# EAGLE design Pit Crew (EAGLE 6.6.0)

## Sheet 1 of 2
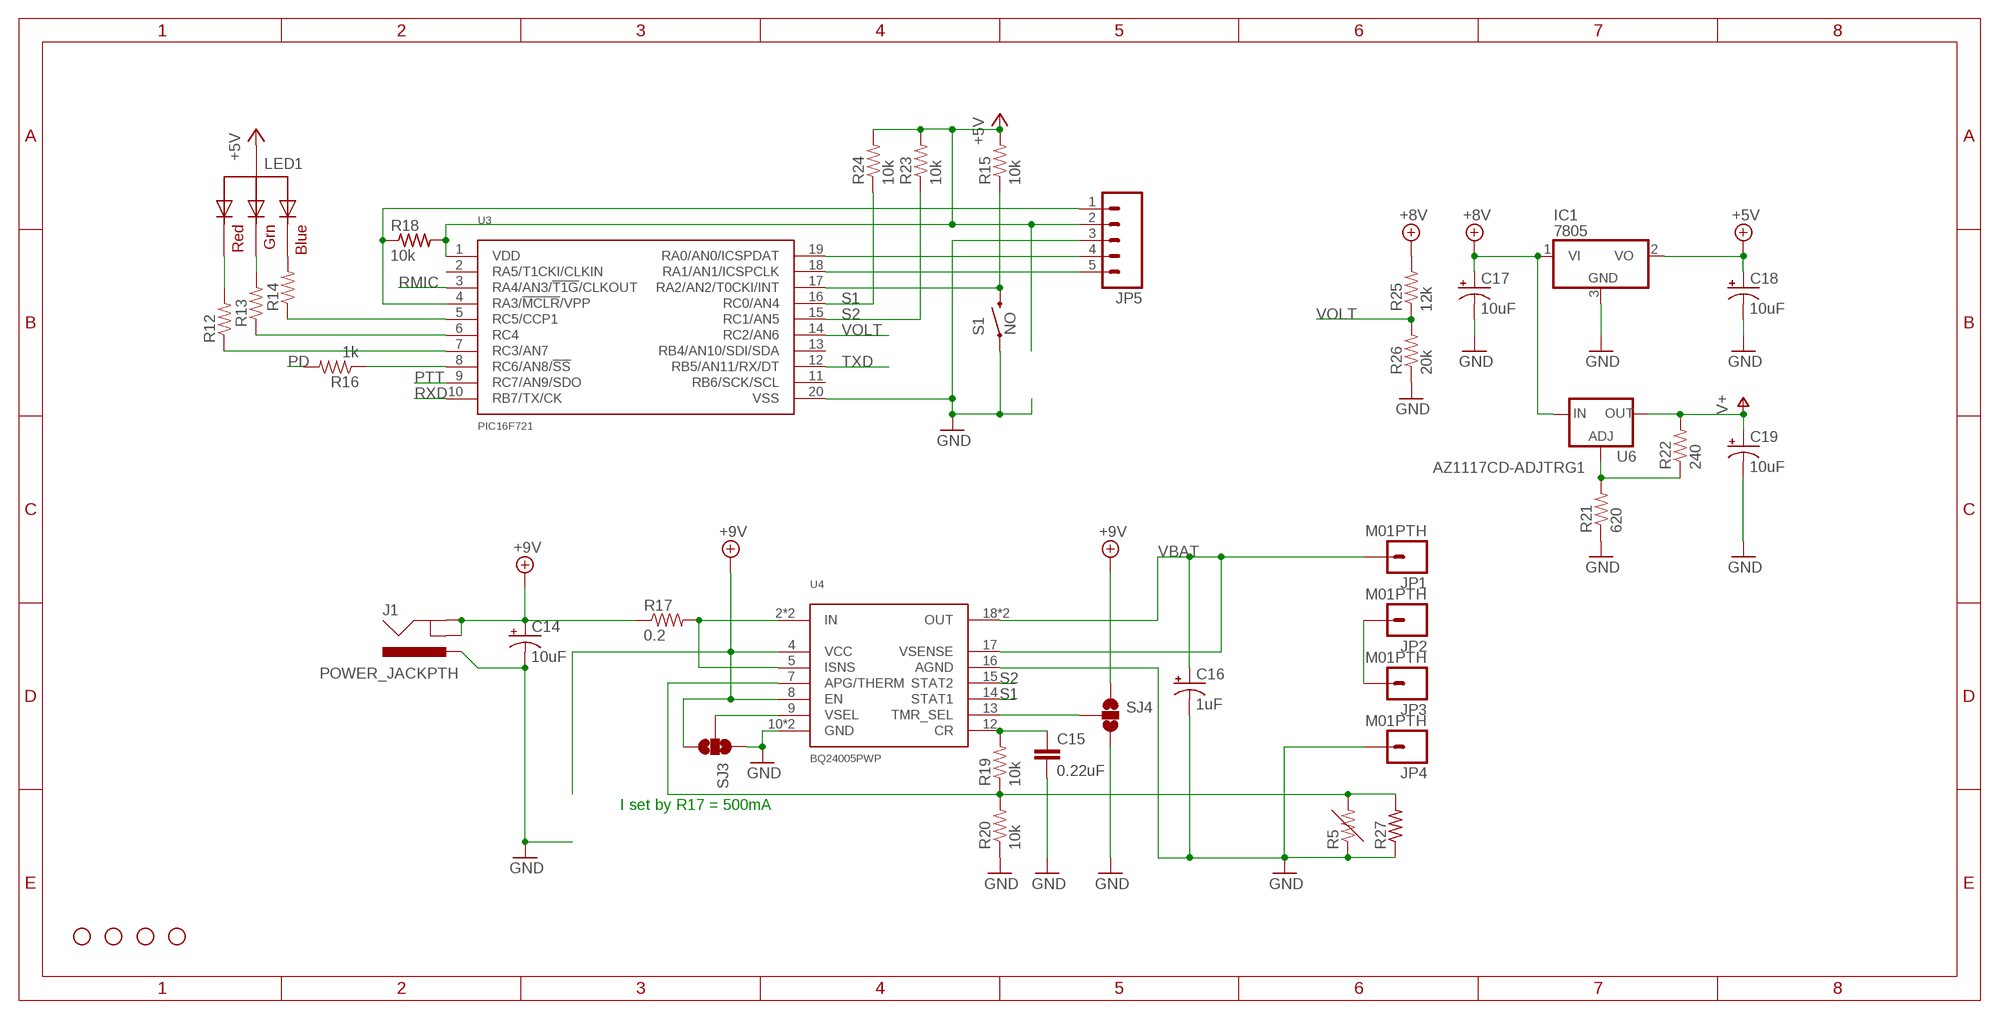
[diagram p0: schematic, sheet 1]

### Parts
C14  10uF  10UF-TANT  [EIA3216]
C15  0.22uF  CAP0805  [0805]
C16  1uF  10UF-TANT  [EIA3216]
C17  10uF  10UF-TANT  [EIA3216]
C18  10uF  10UF-TANT  [EIA3216]
C19  10uF  10UF-TANT  [EIA3216]
IC1  7805  7806DT  [TO252]
J1  POWER_JACKPTH  [POWER_JACK_PTH]
JP1  M01PTH  [1X01]
JP2  M01PTH  [1X01]
JP3  M01PTH  [1X01]
JP4  M01PTH  [1X01]
JP5  M05LOCK_LONGPADS  [1X05_LOCK_LONGPADS]
LED1  RGBLED_CA-5MM  [LED5MMRGB]
R5  RESISTOR0805-RES  [0805]
R12  RESISTOR0805-RES  [0805]
R13  RESISTOR0805-RES  [0805]
R14  RESISTOR0805-RES  [0805]
R15  10k  RESISTOR0805-RES  [0805]
R16  1k  RESISTOR0805-RES  [0805]
R17  0.2  RESISTOR2512  [R2512]
R18  10k  R-US_R0805  [R0805]
R19  10k  RESISTOR0805-RES  [0805]
R20  10k  RESISTOR0805-RES  [0805]
R21  620  RESISTOR0805-RES  [0805]
R22  240  RESISTOR0805-RES  [0805]
R23  10k  RESISTOR0805-RES  [0805]
R24  10k  RESISTOR0805-RES  [0805]
R25  12k  RESISTOR0805-RES  [0805]
R26  20k  RESISTOR0805-RES  [0805]
R27  R-US_0207/7  [0207/7]
S1  NO  SWITCH-MOMENTARY-2SIDE_EZ  [TACTILE-PTH-SIDEEZ]
SJ3  SOLDERJUMPER_2WAYS  [SJ_3]
SJ4  SOLDERJUMPER_2WAYS  [SJ_3]
STANDOFF1  STAND-OFF  [STAND-OFF]
STANDOFF2  STAND-OFF  [STAND-OFF]
STANDOFF3  STAND-OFF  [STAND-OFF]
STANDOFF4  STAND-OFF  [STAND-OFF]
U3  PIC16F721  [SSOP-20]
U4  BQ24005PWP  [HTSSOP-20]
U6  AZ1117CD-ADJTRG1  V_REG_317DPACK  [V-REG_DPACK]

### Nets
+5V: C18.A(+) IC1.2(VO) JP5.2 LED1.2(VCC) R15.2 R18.2 R23.2 R24.2 U3.1(VDD) ; also sheet 2
+8V: C17.A(+) IC1.1(VI) R25.2 U6.3(IN) ; also sheet 2
+9V: C14.A(+) J1.GND J1.GNDBREAK R17.1 SJ3.3 SJ4.1 U4.4(VCC) U4.8(EN)
GND: C14.C(-) C15.2 C16.C(-) C17.C(-) C18.C(-) C19.C(-) IC1.3(GND) J1.PWR JP4.1 JP5.3 R5.1 R20.1 R21.1 R26.1 R27.1 S1.1 SJ3.1 SJ4.3 U3.20(VSS) U4.10(GND) U4.16(AGND) U4.EP(GND) ; also sheet 2
N$11: LED1.1(RED) R12.2
N$13: LED1.4(BLUE) R14.2
N$19: LED1.3(GREEN) R13.2
N$20: JP2.1 JP3.1
N$21: R14.1 U3.5(RC5/CCP1)
N$22: R13.1 U3.6(RC4)
N$23: R12.1 U3.7(RC3/AN7)
N$24: R15.1 S1.2 U3.17(RA2/AN2/T0CKI/INT)
N$25: R16.1 U3.8(RC6/AN8/!SS!)
N$27: JP5.1 R18.1 U3.4(RA3/!MCLR!/VPP)
N$28: JP5.4 U3.19(RA0/AN0/ICSPDAT)
N$29: JP5.5 U3.18(RA1/AN1/ICSPCLK)
N$31: R17.2 U4.2(IN) U4.3(IN) U4.5(ISNS)
N$32: R21.2 R22.1 U6.1(ADJ)
N$33: SJ3.2 U4.9(VSEL)
N$34: R5.2 R19.1 R20.2 R27.2 U4.7(APG/THERM)
N$35: C15.1 R19.2 U4.12(CR)
N$36: SJ4.2 U4.13(TMR_SEL)
PD: R16.2 ; also sheet 2
PTT: U3.9(RC7/AN9/SDO) ; also sheet 2
RMIC: U3.3(RA4/AN3/!T1G!/CLKOUT) ; also sheet 2
RXD: U3.10(RB7/TX/CK) ; also sheet 2
S1: R24.1 U3.16(RC0/AN4) U4.14(STAT1)
S2: R23.1 U3.15(RC1/AN5) U4.15(STAT2)
TXD: U3.12(RB5/AN11/RX/DT) ; also sheet 2
V+: C19.A(+) R22.2 U6.4(OUT) ; also sheet 2
VBAT: C16.A(+) JP1.1 U4.17(VSENSE) U4.18(OUT) U4.19(OUT) ; also sheet 2
VOLT: R25.1 R26.2 U3.14(RC2/AN6)
Unconnected: U3.2(RA5/T1CKI/CLKIN) U3.11(RB6/SCK/SCL) U3.13(RB4/AN10/SDI/SDA)

### Notes on the sheet
- I set by R17 = 500mA

## Sheet 2 of 2
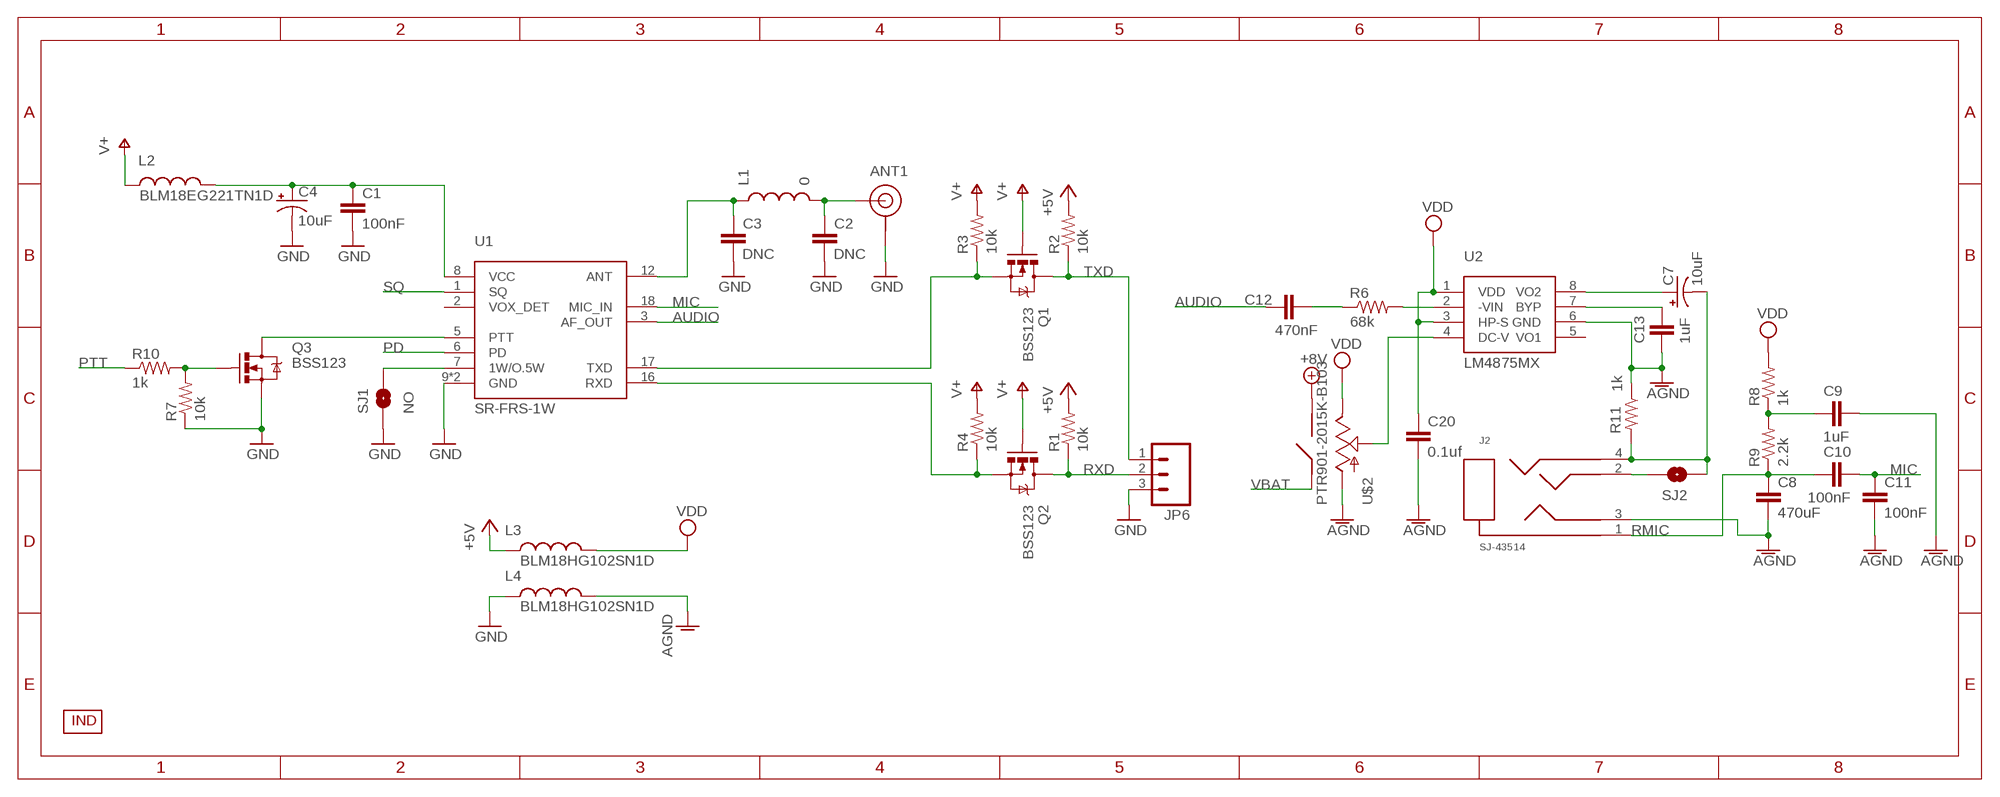
[diagram p1: schematic, sheet 2]

### Parts
ANT1  SMA  [CONSMA002]
C1  100nF  CAP0805  [0805]
C2  DNC  CAP0805  [0805]
C3  DNC  CAP0805  [0805]
C4  10uF  CAP_POL1206  [EIA3216]
C7  10uF  10UF-TANT  [EIA3216]
C8  470uF  CAP0805  [0805]
C9  1uF  CAP0805  [0805]
C10  100nF  CAP0805  [0805]
C11  100nF  CAP0805  [0805]
C12  470nF  CAP0805  [0805]
C13  1uF  CAP0805  [0805]
C20  0.1uf  CAP0805  [0805]
J2  SJ-43514  [SJ-43514]
JP6  M03LOCK  [1X03_LOCK]
L1  0  INDUCTOR1007  [1007]
L2  BLM18EG221TN1D  INDUCTOR0603  [0603]
L3  BLM18HG102SN1D  INDUCTOR0603  [0603]
L4  BLM18HG102SN1D  INDUCTOR0603  [0603]
Q1  BSS123  MOSFET-NCHANNELBSS123LT1G  [SOT23]
Q2  BSS123  MOSFET-NCHANNELBSS123LT1G  [SOT23]
Q3  BSS123  MOSFET-NCHANNELBSS123LT1G  [SOT23]
R1  10k  RESISTOR0805-RES  [0805]
R2  10k  RESISTOR0805-RES  [0805]
R3  10k  RESISTOR0805-RES  [0805]
R4  10k  RESISTOR0805-RES  [0805]
R6  68k  RESISTOR0805-RES  [0805]
R7  10k  RESISTOR0805-RES  [0805]
R8  1k  RESISTOR0805-RES  [0805]
R9  2.2k  RESISTOR0805-RES  [0805]
R10  1k  RESISTOR0805-RES  [0805]
R11  1k  RESISTOR0805-RES  [0805]
SJ1  NO  SOLDERJUMPERNO  [SJ_2S-NO]
SJ2  SOLDERJUMPERNO  [SJ_2S-NO]
U1  SR-FRS-1W  [SR-FRS-1W]
U2  LM4875MX  [SO-8]
U$2  PTR901-2015K-B103  [PTR901-2015K-B103]
U$3  INDPK1  [PICKIT-PIN-1]

### Nets
+5V: L3.1 R1.2 R2.2 ; also sheet 1
+8V: U$2.S1 ; also sheet 1
AGND: C8.2 C9.2 C11.2 C13.1 C20.2 J2.3 L4.2 R11.1 U2.6(GND) U$2.1(CCW)
AUDIO: C12.1 U1.3(AF_OUT)
GND: ANT1.1(GND) ANT1.2(GND) ANT1.3(GND) ANT1.4(GND) C1.2 C2.2 C3.2 C4.C(-) JP6.3 L4.1 Q3.2(S) R7.1 SJ1.1 U1.9(GND) U1.10(GND) ; also sheet 1
MIC: C10.2 C11.1 U1.18(MIC_IN)
N$1: C3.1 L1.1 U1.12(ANT)
N$2: ANT1.C(SIGNAL) C2.1 L1.2
N$3: C1.1 C4.A(+) L2.2 U1.8(VCC)
N$4: SJ1.2 U1.7(1W/O.5W)
N$6: J2.2 SJ2.1
N$7: U2.4(DC-V) U$2.2(W)
N$8: Q2.2(S) R4.1 U1.16(RXD)
N$9: Q1.2(S) R3.1 U1.17(TXD)
N$10: C13.2 U2.7(BYP)
N$12: C12.2 R6.1
N$14: R6.2 U2.2(-VIN)
N$15: C9.1 R8.1 R9.2
N$17: C7.A(+) U2.8(VO2)
N$18: Q3.1(G) R7.2 R10.2
N$26: C7.C(-) J2.4 R11.2 SJ2.2
PD: U1.6(PD) ; also sheet 1
PTT: R10.1 ; also sheet 1
PTT-1: Q3.3(D) U1.5(PTT)
RMIC: C8.1 C10.1 J2.1 R9.1 ; also sheet 1
RXD: JP6.2 Q2.3(D) R1.1 ; also sheet 1
SQ: U1.1(SQ)
TXD: JP6.1 Q1.3(D) R2.1 ; also sheet 1
V+: L2.1 Q1.1(G) Q2.1(G) R3.2 R4.2 ; also sheet 1
VBAT: U$2.S2 ; also sheet 1
VDD: C20.1 L3.2 R8.2 U2.1(VDD) U2.3(HP-S) U$2.3(CW)
Unconnected: U1.2(VOX_DET) U2.5(VO1)

## Library data of the parts
ANT1 = FSAE Eletric:SMA
C1-C3 C8-C13 C15 C20 = SparkFun-Passives:CAP: Capacitor Standard 0603 ceramic capacitor, and 0.1" leaded capacitor.
C4 = SparkFun-Passives:CAP_POL: Capacitor Polarized These are standard SMD and PTH capacitors. Normally 10uF, 47uF, and 100uF in electrolytic and tantalum varieties. Always verify the external diameter of the through hole cap, it varies with capacity, voltage, and manufacturer. The EIA devices should be standard.
C7 C14 C17-C19 = SparkFun-Capacitors:10UF-TANT: 10uF Tantalum SMT CAP-00811- 16V 10% (EIA-3216); PROD_ID: CAP-00811
C16 = SparkFun-Capacitors:10UF-TANT: 10uF Tantalum SMT CAP-00811- 16V 10% (EIA-3216); PROD_ID: CAP-00811; VALUE: 10uF
IC1 = adafruit:78*: Positive VOLTAGE REGULATOR Added bigger pads to the TO-92 package
J1 = SparkFun-Connectors:POWER_JACK: Power Jack This is the standard 5.5mm barrel jack for power. The PTH is the most common, proven, reliable, footprint. The Slot footprint only works if the mill layer is transmitted to the PCB fab house so be warned. Spark Fun Electronics SKU : PRT-00119 SMT: CONN-08106 Mating wall wart : TOL-00298 (and others)
J2 = FSAE Eletric:SJ-43514; PARTNO: SJ-43514
JP1-JP4 = SparkFun-Connectors:M01: Header 1 Standard 1-pin 0.1" header. Use with straight break away headers (SKU : PRT-00116), right angle break away headers (PRT-00553), swiss pins (PRT-00743), machine pins (PRT-00117), and female headers (PRT-00115).
JP5 = SparkFun-Connectors:M05: Header 5 Standard 5-pin 0.1" header. Use with straight break away headers (SKU : PRT-00116), right angle break away headers (PRT-00553), swiss pins (PRT-00743), machine pins (PRT-00117), and female headers (PRT-00115). Molex polarized connector foot print use with SKU : PRT-08230 with associated crimp pins and housings.
JP6 = SparkFun-Connectors:M03: Header 3 Standard 3-pin 0.1" header. Use with straight break away headers (SKU : PRT-00116), right angle break away headers (PRT-00553), swiss pins (PRT-00743), machine pins (PRT-00117), and female headers (PRT-00115). Molex polarized connector foot print use with SKU : PRT-08232 with associated crimp pins and housings.
L1-L4 = SparkFun-Passives:INDUCTOR: Inductors Basic Inductor/Choke - 0603 and 1206. Footprints are not proven and vary greatly between part numbers. SRN6045- 33uH, 20% 1.4A
LED1 = adafruit:RGBLED_CA: RGB LED, common-anode 5MM Staggered pins 5mm Piranha package http://www.ladyada.net/library/pcb/eaglelibrary.html
Q1-Q3 = SparkFun-DiscreteSemi:MOSFET-NCHANNEL: Common NMOSFET Parts MFG P/N Store ID Prod ID FDD8780 TRANS-09984 SI7820DN TRANS-11055 FDS6630A IC-08089 2N7002PW TRANS-11151 FQP30N06L COM-10213 TRANS-10060 BSS123LT1G TRANS-08345 BSS138 TRANS-00830 BS170 2N7000; PROD_ID: TRANS-08345
R1-R17 R19-R26 = SparkFun-Passives:RESISTOR: Resistor Basic schematic elements and footprints for 0603, 1206, and PTH resistors.
R18 R27 = adafruit:R-US_: RESISTOR, American symbol
S1 = SparkFun-Electromechanical:SWITCH-MOMENTARY-2: Various NO switches- pushbuttons, reed, etc
SJ1 SJ2 = SparkFun-Passives:SOLDERJUMPER: Solder Jumper Standard SMD solder jumper. Used to automate production. Two varients : Normally Open and Normally Closed are the same, but have different paste layers. NC will have a large amount of paste and should jumper during reflow.
SJ3 SJ4 = SparkFun-Passives:SOLDERJUMPER_2WAY: Solder Jumper 2 way solder jumper
STANDOFF1-STANDOFF4 = SparkFun-Electromechanical:STAND-OFF: #4 Stand Off This is the mechanical footprint for a #4 phillips button head screw. Use the keepout ring to avoid running the screw head into surrounding components. SKU : PRT-00447
U1 = FSAE Eletric:SR-FRS-1W
U2 = FSAE Eletric:LM4875MX
U3 = FSAE Eletric:PIC16F721
U4 = FSAE Eletric:BQ24005PWP
U6 = SparkFun-PowerIC:V_REG_317: Voltage Regulator Standard LM317 adjustable voltage regulator. AOI (Adjust Output Input). Google 'LM317 Calculator' for easy to use app to get the two resistor values needed. 240/720 for 5V output. 240/390 for 3.3V output. Spark Fun Electronics SKU : COM-00527
U$2 = FSAE Eletric:PTR901-2015K-B103
U$3 = FSAE Eletric:IND

## Board
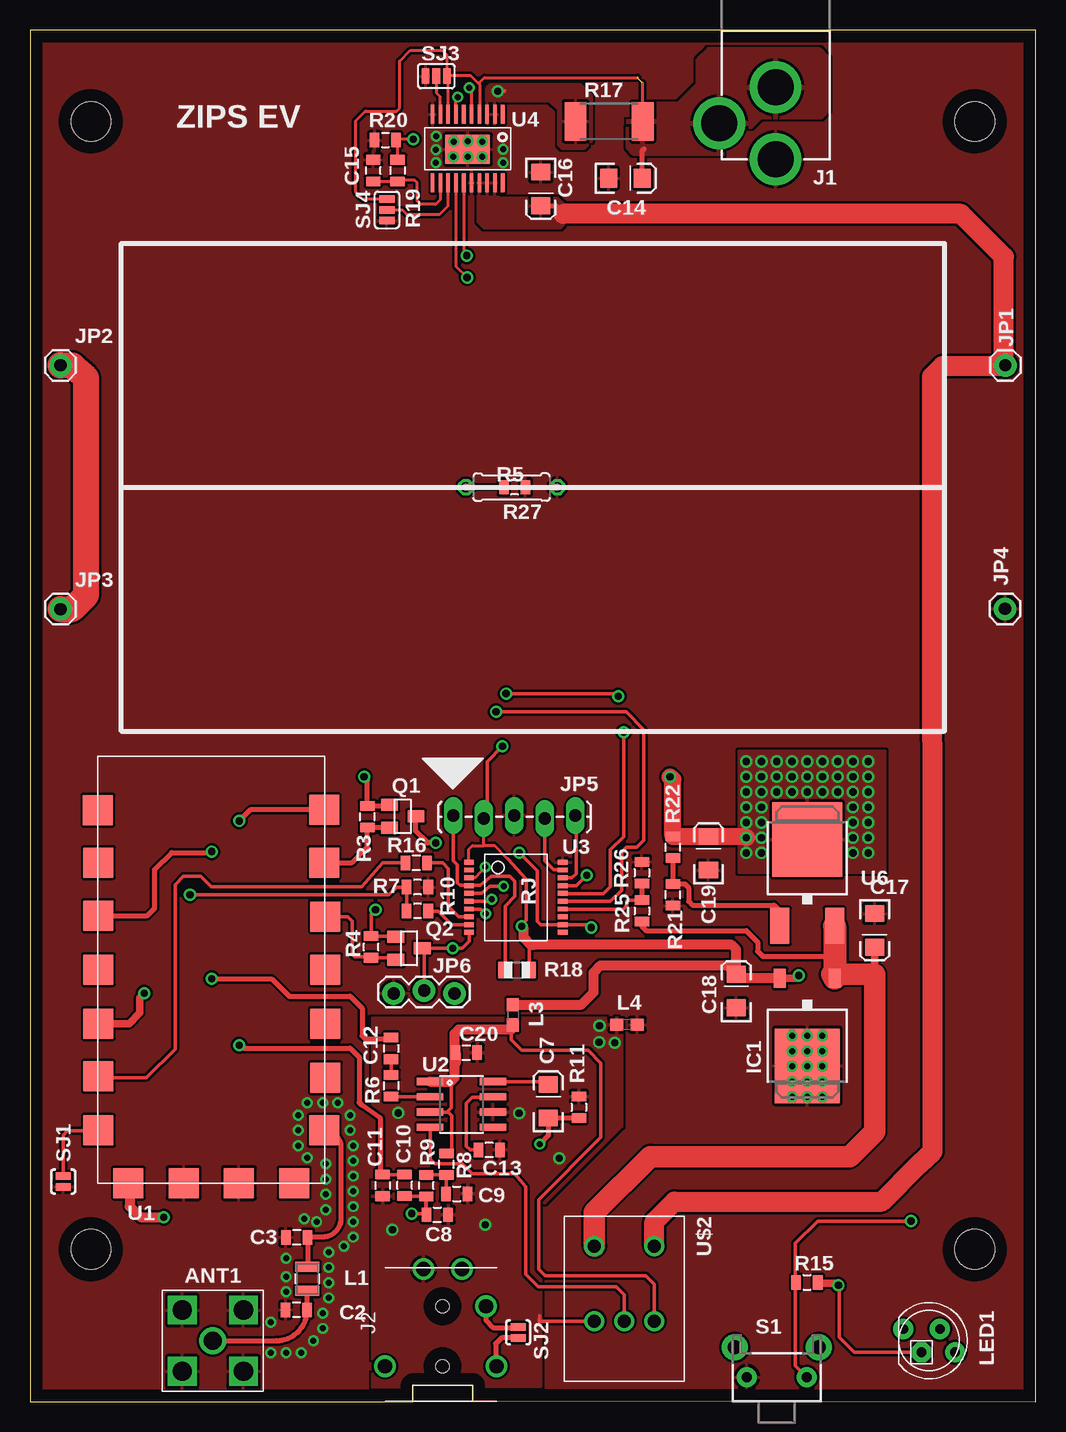
[diagram p2: board, top side]
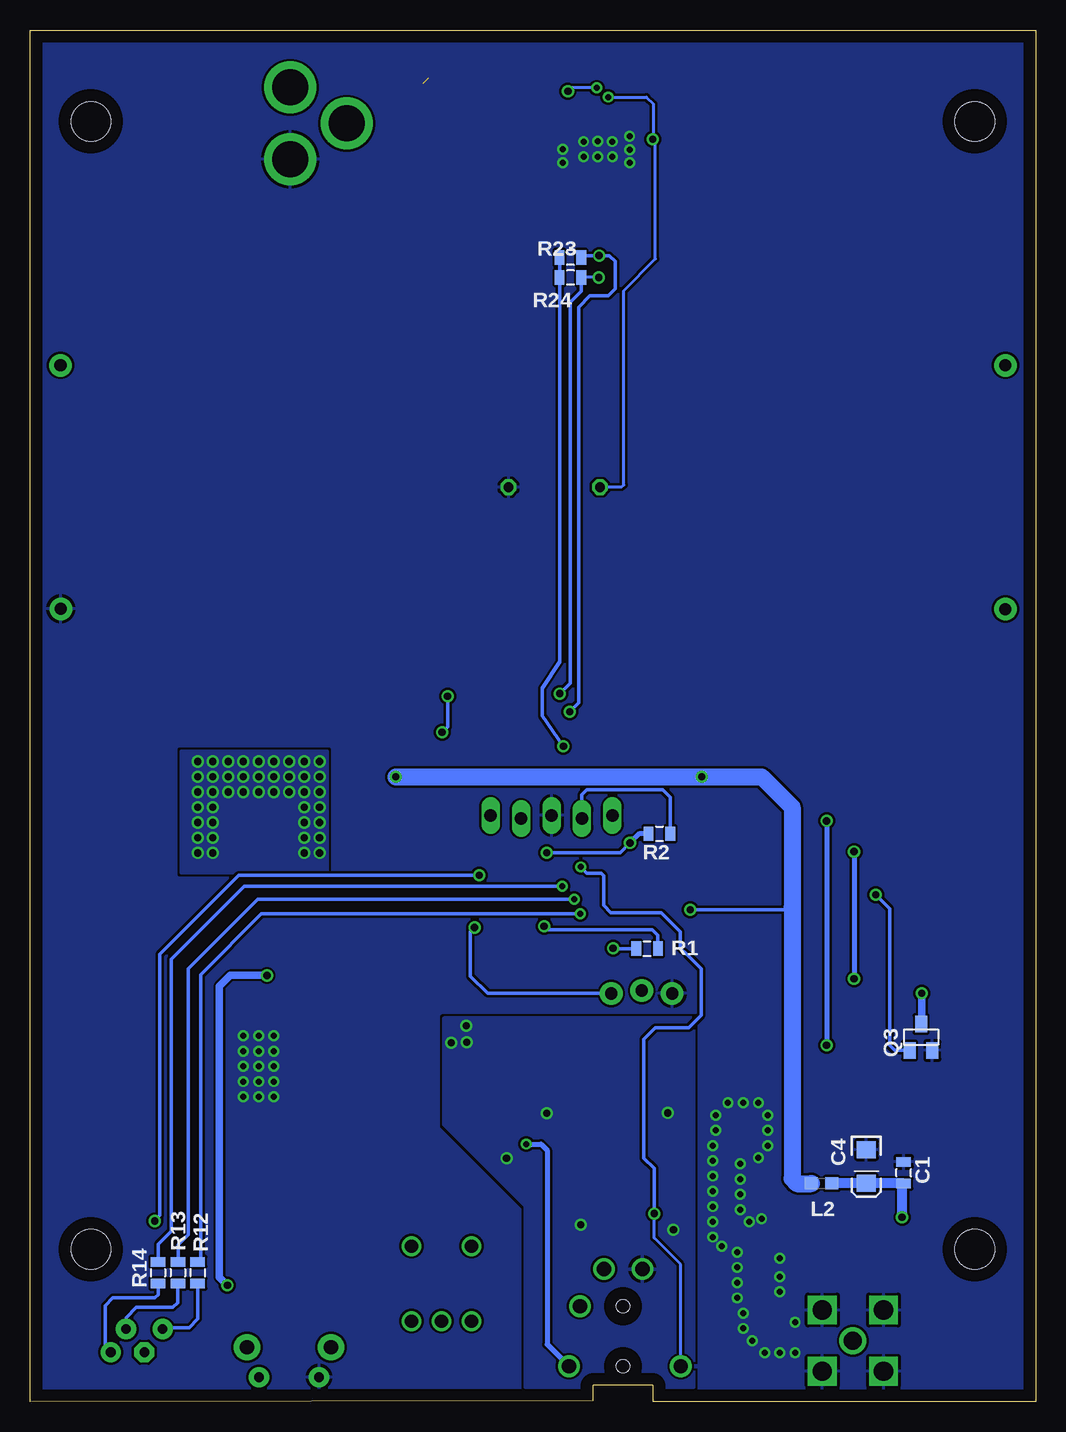
[diagram p3: board, bottom side, seen from below]

Size 83.82 x 114.3 mm. Coordinates in mm from the lower left corner, seen from the top.
Outline: 0,0 31.9,0 31.9,1.32 31.93,1.35 36.88,1.35 36.91,1.32 36.91,0.05 83.82,0 83.82,114.3 0,114.3 0,0
Copper layers (1*16): Top 0.035mm / dielectric 1.5mm / Bottom 0.035mm
Design rules "default": minimum track width 10mil, minimum drill 24mil, track to track 8mil, track to pad 8mil, pad to pad 8mil, via to via 8mil, smd to smd 8mil, copper to edge 40mil, drill to drill 8mil, minimum pad ring 10mil, minimum via ring 8mil, stop-mask expansion 4mil, vias tented up to drill 0mil, thermal gap 10mil

### Footprints (pad centres in the part's own frame; a part is rotated, then mirrored left to right if it is on the bottom)
CONSMA002 = drill 1.6 square: 1 -2.55,2.55; 2 2.55,2.55; 3 2.55,-2.55; 4 -2.55,-2.55 | drill 1.5: C 0,0
0805 = smd 0.8 x 1.2: 1 -0.9,0; 2 0.9,0
EIA3216 = smd 1.4 x 1.6: A 1.4,0; C -1.4,0
TO252 = smd 1 x 1.6: 1 -2.28,-4.8; 2 2.28,-4.8 | smd 5.4 x 6.2: 3 0,2.5
POWER_JACK_PTH = drill 2.997 pad 4.318: GND 0,7.7; GNDBREAK 4.7,10.7; PWR 0,13.7
SJ-43514 = drill 1.2: 1 0,4.8; 2 5,-3.6; 3 8.1,1.6; 4 0,-4.5; 5 8.1,-1.6 | hole 1.1: 0,0; 5,0
1X01 = drill 1.016 pad 1.88: 1 0,0
1X05_LOCK_LONGPADS = drill 1.016 long: 1 0,0; 2 2.54,-0.254; 3 5.08,0; 4 7.62,-0.254; 5 10.16,0
1X03_LOCK = drill 1.016 pad 1.88: 1 0,0.127; 2 2.54,-0.127; 3 5.08,0.127
1007 = smd 2 x 0.8: 1 0,1; 2 0,-1
0603 = smd 1.1 x 1: 1 -0.85,0; 2 0.85,0
LED5MMRGB = drill 0.8 pad 1.676: 1 -2.159,0.968; 3 0.889,0.968; 4 2.159,-0.968 | drill 0.8 pad 1.676 octagon: 2 -0.635,-0.968
SOT23 = smd 1 x 1.4: 1 -0.95,-1.1; 2 0.95,-1.1; 3 0,1.1
R2512 = smd 1.8 x 3.2: 1 -2.8,0; 2 2.8,0
R0805 = smd 1.1 x 1.4: 1 -1,0; 2 1,0
0207/7 = drill 0.813 octagon: 1 -3.81,0; 2 3.81,0
TACTILE-PTH-SIDEEZ = drill 0.8 pad 1.7: 1 -2.5,0; 2 2.5,0 | drill 1.2 pad 2.2: ANCHOR1 -3.5,2.5; ANCHOR2 3.5,2.5
SJ_2S-NO = smd 0.635 x 1.27: 1 -0.45,0; 2 0.45,0
SJ_3 = smd 0.635 x 1.27: 1 -0.889,0; 2 0,0; 3 0.889,0
STAND-OFF = hole 3.302: 0,0
SR-FRS-1W = smd 2.5 x 2.5: 1 0,31.1; 2 0.04,26.72; 3 0.04,22.32; 4 0.04,17.82; 5 0.04,13.32; 6 0.04,8.92; 7 0.04,4.42; 8 2.54,0.02; 9 7.14,0.02; 10 11.74,0.02; 11 16.34,0.02; 12 18.84,4.42; 13 18.94,8.82; 14 18.94,13.32; 15 18.94,17.82; 16 18.94,22.22; 17 18.84,26.72; 18 18.84,31.12
SO-8 = smd 0.61 x 2.21: 1 -1.905,-2.616; 2 -0.635,-2.616; 3 0.635,-2.616; 4 1.905,-2.616; 5 1.905,2.616; 6 0.635,2.616; 7 -0.635,2.616; 8 -1.905,2.616
SSOP-20 = smd 0.813 x 0.406: 1 -3.9,2.925; 2 -3.9,2.275; 3 -3.9,1.625; 4 -3.9,0.975; 5 -3.9,0.325; 6 -3.9,-0.325; 7 -3.9,-0.975; 8 -3.9,-1.625; 9 -3.9,-2.275; 10 -3.9,-2.925; 11 3.9,-2.925; 12 3.9,-2.275; 13 3.9,-1.625; 14 3.9,-0.975; 15 3.9,-0.325; 16 3.9,0.325; 17 3.9,0.975; 18 3.9,1.625; 19 3.9,2.275; 20 3.9,2.925
HTSSOP-20 = smd 0.3 x 1.6: 1 -2.925,-2.9; 2 -2.275,-2.9; 3 -1.625,-2.9; 4 -0.975,-2.9; 5 -0.325,-2.9; 6 0.325,-2.9; 7 0.975,-2.9; 8 1.625,-2.9; 9 2.275,-2.9; 10 2.925,-2.9; 11 2.925,2.8; 12 2.275,2.8; 13 1.625,2.8; 14 0.975,2.8; 15 0.325,2.8; 16 -0.325,2.8; 17 -0.975,2.8; 18 -1.625,2.8; 19 -2.275,2.8; 20 -2.925,2.8 | smd 3.7 x 2.4: EP 0,0
V-REG_DPACK = smd 1.6 x 3: 1 -2.28,-4.8; 3 2.28,-4.8 | smd 5.8 x 6.2: 4 0,2.38
PTR901-2015K-B103 = drill 1.1: 1 0,-2.5; 2 0,0; 3 0,2.5; S1 -6.25,-2.5; S2 -6.25,2.5

### Placement (x,y rotation side)
ANT1  15.24,5.08 0 top
C1  11.02,19.08 90 bottom
C2  22.2,7.65 180 top
C3  22.22,13.69 180 top
C4  14.12,19.58 270 bottom
C7  43.19,25.03 90 top
C8  33.93,15.57 0 top
C9  35.56,17.31 0 top
C10  31.22,18.02 90 top
C11  29.39,18.01 270 top
C12  30.09,29.43 270 top
C13  38.27,20.97 180 top
C14  49.63,101.96 0 top
C15  28.6,102.59 90 top
C16  42.57,101.07 270 top
C17  70.38,39.27 270 top
C18  58.85,34.21 90 top
C19  56.54,45.69 90 top
C20  36.36,29.08 0 top
IC1  64.77,30.48 180 top
J1  62.13,117.22 180 top
J2  34.39,2.95 90 top
JP1  81.28,86.36 0 top
JP2  2.54,86.36 0 top
JP3  2.54,66.04 0 top
JP4  81.25,66.07 0 top
JP5  35.28,48.84 0 top
JP6  35.38,34.14 180 top
L1  23.11,10.24 0 top
L2  17.86,18.19 0 bottom
L3  40.25,32.23 270 top
L4  49.75,31.42 180 top
LED1  74.93,5.08 0 top
Q1  31.06,48.77 270 top
Q2  31.58,37.78 270 top
Q3  9.56,30.37 0 bottom
R1  32.4,37.74 0 bottom
R2  31.37,47.32 0 bottom
R3  28.12,48.74 90 top
R4  28.42,37.88 90 top
R5  40.39,76.2 180 top
R6  30.1,26.31 270 top
R7  32.28,42.88 180 top
R8  34.7,19.77 90 top
R9  33.02,18 90 top
R10  32.28,40.88 180 top
R11  45.75,24.52 270 top
R12  69.85,10.74 270 bottom
R13  71.5,10.74 270 bottom
R14  73.15,10.74 270 bottom
R15  64.74,9.93 0 top
R16  32.18,44.89 180 top
R17  48.26,106.68 180 top
R18  40.59,35.97 0 top
R19  30.63,102.59 270 top
R20  29.62,105.13 0 top
R21  53.57,42.24 90 top
R22  53.57,46.2 90 top
R23  38.79,95.33 180 bottom
R24  38.79,93.68 180 bottom
R25  50.99,40.89 270 top
R26  50.99,44.07 270 top
R27  40.13,76.2 180 top
S1  62.23,2.03 0 top
SJ1  2.77,18.34 90 top
SJ2  40.68,5.77 270 top
SJ3  33.86,110.46 0 top
SJ4  29.74,99.31 270 top
STANDOFF1  5.08,12.7 0 top
STANDOFF2  78.74,12.7 0 top
STANDOFF3  5.08,106.68 0 top
STANDOFF4  78.74,106.68 0 top
U1  5.66,18.19 0 top
U2  35.97,24.77 270 top
U3  40.49,42.02 0 top
U4  36.47,104.37 180 top
U6  64.77,44.45 0 top
U$2  49.53,6.71 270 top
U$3  35.22,51.05 0 top

### Tracks (layer width: path | path; a pad name or v marks a point on that pad's centre or on a via)
+5V  (via drill 0.6)
  Top 0.254: 36.55,44.96 36.55,46.02 36.85,46.33 37.82,46.33 | 37.82,46.33 JP5.2 | 39.81,45.25 39.79,45.25 38.71,46.33 37.82,46.33
  Top 0.305: 36.55,44.96 U3.1 | v40.98,39.62 40.98,39.74 41.36,40.12 41.36,43.55 39.81,45.25 | R18.2 41.59,37.68 41.97,38.06 | v39.37,54.61 38.1,53.34 38.1,48.87 JP5.2 | LED1.2 68.69,4.11 67.44,5.36 67.44,9.63 v67.37,9.7
  Top 0.61: R15.2 65.71,9.87 67.2,9.87 v67.37,9.7 67.54,9.53 | IC1.2 63.84,35.28 v64.07,35.51
  Top 0.813: IC1.2 59.19,35.28 C18.A | C18.A 58.85,37.68 58.47,38.06 41.97,38.06 41.71,38.06 41.13,38.63 41.13,39.47 v40.98,39.62 | L3.1 45.95,33.08 46.96,34.1 46.96,35.78 47.54,36.35 58.12,36.35 C18.A
  Bottom 0.305: R2.2 30.47,50.37 31.08,50.98 37.44,50.98 37.86,50.56 37.86,48.63 JP5.2 | R1.2 31.5,38.86 31.95,39.32 40.68,39.32 v40.98,39.62 40.87,39.51 | R23.2 R24.2 39.69,61.66 41.15,59.44 41.15,57.15 v39.37,54.61
  Bottom 0.61: v64.07,35.51 67.12,35.51 68.03,34.59 68.03,10.36 v67.37,9.7
+8V
  Top 0.406: R25.2 50.99,39.6 51.35,39.24 59.69,39.24 60.64,38.29 60.64,37.53 61.06,37.11 66.97,37.11 67.05,37.03
  Top 0.61: C17.A 70.38,35.71 70.28,35.61
  Top 1.778: U$2.S1 47.03,15.76 51.69,20.42 68.3,20.42 70.38,22.5 70.38,35.61 70.28,35.61 66.8,35.61 IC1.1
  Top 1.93: U6.3 67.05,37.03 IC1.1
+9V  (1 unrouted)
  Top 0.254: 37.46,107.31 U4.4 37.46,107.28 37.46,107.31 | 37.46,109.75 36.7,110.52 34.95,110.52 34.85,110.41 U4.8 34.85,110.36 SJ3.3 34.72,110.49 34.72,112.22 34.34,112.6 31.7,112.6 30.81,111.71 30.81,107.8 30.56,107.54 27.94,107.54 27.15,106.76 27.15,100.79 27.74,100.2 SJ4.1 | 37.46,109.75 37.46,107.31 | R17.1 51.06,109.87 | 37.46,109.75 37.46,109.93 37.87,110.34 50.61,110.34
  Top 0.406: C14.A 51.03,104.25 51.18,104.39
  pour Top: 50.14,108.15 54.1,108.15 55.7,109.75 55.7,111.81 56.59,112.7 65.71,112.7 66.5,111.91 66.5,107.65 65.86,107.01 60.81,107.01 57.78,103.99 50.34,103.99 49.86,104.52 49.91,107.92
AGND  (via drill 0.6)
  Top 0.305: 42.2,3.81 42.09,3.92 | U$2.1 42.42,6.71 42.47,7.14
  other vias: 30.68,24.05 30.2,14.33 37.93,14.74 44.11,20.27 40.75,24.04 47.46,31.32 47.42,29.95 48.72,29.91
  pour Top: 28.56,1.18 42.55,1.3 42.58,16.23 49.29,22.94 49.33,22.94 49.33,32 28.56,31.97
  pour Bottom: 28.52,1.18 42.55,1.18 42.55,16.34 42.62,16.34 49.33,23.05 49.33,31.93 49.25,32 28.52,32
AUDIO  (via drill 0.6)
  Top 0.406: U1.3 9.79,40.51 10.39,41.11 10.39,44.35 11.8,45.76 15.07,45.76 v15.15,45.83 | v15.15,35.23 20.14,35.23 21.59,33.78 26.67,33.78 27.69,32.77 27.69,30.48 27.94,30.23 29.99,30.23 C12.1
  Bottom 0.406: v15.15,45.83 v15.15,35.23
GND  (via drill 0.5)
  other vias: 39.42,103.25 39.42,104.37 37.69,103.73 36.5,103.73 35.28,103.73 37.69,105 36.5,105.03 35.31,105 33.83,103.25 33.83,104.32 33.86,105.46 63.5,30.48 64.77,30.48 66.04,30.48 63.5,29.21 64.77,29.21 66.04,29.21 63.5,27.94 64.77,27.94 66.04,27.94 63.5,26.67 64.77,26.67 66.04,26.67 63.5,25.4 64.77,25.4 66.04,25.4 26.67,22.61 26.92,21.34 26.92,20.07 26.92,18.8 26.92,17.53 26.92,16.26 26.92,14.99 26.92,13.72 26.16,12.95 24.89,12.45 24.89,11.18 24.89,9.91 24.89,8.64 24.38,7.37 24.38,6.1 23.62,5.08 22.61,4.06 21.34,4.06 20.07,4.06 20.07,6.6 21.34,9.14 21.34,10.41 21.34,11.94 22.86,15.24 23.88,14.99 24.64,16 24.64,17.27 24.64,18.54 24.64,19.81 26.67,23.88 25.65,24.89 24.38,24.89 23.11,24.89 22.35,23.88 22.35,22.61 22.35,21.34 23.11,20.32
  pour Top (rank 6): 0,114.3 83.82,114.3 83.82,0 36.91,0.03 36.83,0.1 36.83,1.35 36.8,1.37 31.93,1.37 31.93,0 0,0
  pour Bottom (rank 5): 0,114.3 83.82,114.3 83.82,0 36.91,0.03 36.88,0.05 36.88,1.32 31.95,1.32 31.93,1.3 31.93,0.05 31.88,0 0,0
MIC  (via drill 0.6)
  Top 0.305: C10.2 C11.1
  Top 0.406: U1.18 18.36,49.31 v17.44,48.39 | 27.51,24.82 27.64,24.72 | 27.64,24.72 29.17,23.66 29.17,19.12 C11.1 | v17.44,29.7 17.54,29.7 17.78,29.46 26.67,29.46 27.43,28.7 27.43,24.93 27.64,24.72
  Bottom 0.406: v17.44,48.39 v17.44,29.7
N$1
  Top 0.406: U1.12 arc-90 25.91,21.2 25.91,15.24 arc-90 24.38,13.72 23.15,13.72 arc90 C3.1 23.12,11.25 arc-90 L1.1
N$2
  Top 0.406: ANT1.C 20.53,5.08 arc90 C2.1 23.1,9.22 arc-90 L1.2
N$3  (via drill 0.6)
  Top 0.813: U1.8 8.31,18.21 8.31,16.28 9.22,15.37 v11.15,15.37
  Bottom 0.813: v11.15,15.37 11.15,18.05 C1.1 C4.A L2.2
N$4
  Top 0.305: SJ1.2 2.77,22.21 3.11,22.55 5.65,22.55 U1.7
N$6
  Top 0.406: J2.2 37.99,6.76 38.58,6.17 40.63,6.17 SJ2.1
N$7
  Top 0.305: U2.4 33.35,20.21 33.74,19.81 36.01,19.81 36.84,18.97 40.41,18.97 41.33,17.91 41.33,10.62 42.37,9.58 48.84,9.58 49.53,8.89 U$2.2
N$8
  Top 0.305: U1.16 26.48,40.41 26.85,40.04 26.85,37.3 27.08,37.07 28.34,37.07 R4.1 30.33,36.98 Q2.2
N$9
  Top 0.406: U1.17 26.83,44.91 28.11,46.18 28.11,47.83 R3.1 29.94,47.84 Q1.2
N$10
  Top 0.305: C13.2 36.7,20.97 36.37,21.3 36.37,24.88 36.87,25.38 38.56,25.38 U2.7
N$11
  Bottom 0.305: R12.2 69.85,6.88 70.56,6.17 72.65,6.17 LED1.1
N$12
  Top 0.305: R6.1 30.1,28.51 C12.2
N$13
  Bottom 0.305: R14.2 73.15,8.89 73.41,8.64 76.91,8.64 77.55,8 77.55,4.57 LED1.4
N$14
  Top 0.305: U2.2 30.11,25.4 R6.2
N$15
  Top 0.305: R9.2 34.67,18.9 R8.1 34.7,17.35 C9.1
N$17
  Top 0.305: U2.8 42.95,26.67 C7.A
N$18  (via drill 0.6)
  Top 0.305: R10.2 R7.2 31.37,42.86 30.54,42.86 29.91,42.23 v13.34,42.23
  Bottom 0.305: Q3.1 11.77,29.27 12.18,29.68 12.18,41.07 v13.34,42.23
N$19
  Bottom 0.305: R13.2 71.5,8.26 71.91,7.85 74.96,7.85 75.82,6.99 LED1.3
N$20
  Top 2.184: JP3.1 3.5,66.04 4.67,67.21 4.67,85.31 3.53,86.33 2.55,86.37 JP2.1
N$21  (via drill 0.5)
  Top 0.305: U3.5 37.65,42.35 38.3,42.95 38.99,42.95 v39.46,42.94
  Bottom 0.305: v39.46,42.94 65.98,42.94 72.03,36.88 72.03,14.21 73.14,13.11 73.14,11.66 R14.1
N$22  (via drill 0.5)
  Top 0.305: U3.6 38.3,41.7 v38.47,41.87
  Bottom 0.305: v38.47,41.87 64.83,41.87 70.62,36.08 70.62,13.91 71.46,13.07 71.46,11.68 R13.1
N$23  (via drill 0.5)
  Top 0.305: U3.7 37.58,41.05 v37.97,40.65
  Bottom 0.305: v37.97,40.65 64.53,40.65 69.6,35.59 69.6,11.9 R12.1
N$24  (via drill 0.6)
  Top 0.305: U3.17 45.54,43 v46.39,43.85 | v73.42,15.05 65.63,15.05 63.77,13.18 63.77,10.01 R15.1 63.78,9.87 63.78,2.98 S1.2
  Bottom 0.305: v46.39,43.85 66.43,43.85 72.99,37.3 72.99,15.53 v73.42,15.05
N$25
  Top 0.305: R16.1 34.38,44.9 34.85,44.42 34.85,41.26 35.73,40.39 36.57,40.39 U3.8
N$26  (via drill 0.5)
  Top 0.406: R11.2 43.2,23.62 C7.C 43.19,22.19 v42.47,21.46 | SJ2.2 39.3,5.32 38.81,4.83 38.81,3.03 J2.4
  Bottom 0.406: v42.47,21.46 41.22,21.46 40.72,20.95 40.72,4.77 J2.4
N$27
  Top 0.305: JP5.1 35.28,45.06 35.61,44.73 35.61,43.24 35.84,43.02 36.57,43.02 U3.4 36.6,43.02 37.5,43.02 38.43,43.79 39.97,43.79 40.41,43.37 40.41,42.1 39.59,41.28 R18.1
N$28
  Top 0.305: JP5.4 42.9,45.06 43.65,44.31 44.38,44.31 U3.19
N$29
  Top 0.305: U3.18 45.16,43.65 45.52,44.01 45.52,48.77 JP5.5
N$31  (via drill 0.5, 0.6)
  Top 0.254: U4.5 36.8,109.25 v36.6,109.47 | v38.99,109.19 39.55,109.19 39.6,109.25
  Bottom 0.254: v36.6,109.47 38.71,109.47 v38.99,109.19
  pour Top: 38.07,108 38.07,109.47 38.38,109.78 45.87,109.78 46.76,108.89 46.76,105 46.18,104.42 44.35,104.42 44.07,104.7 44.07,107.65 43.33,108.38 39.09,108.38 38.94,108.23 38.94,106.58 38.81,106.45 38.15,106.45 38.1,106.5 38.1,107.98
N$32
  Top 0.406: R22.1 R21.2 54.57,43.14 54.89,42.82 54.89,41.68 55.19,41.38 62.01,41.38 62.66,40.73 62.66,39.82 U6.1
N$33
  Top 0.254: U4.9 34.2,108.73 33.88,109.04 33.88,110.44 SJ3.2
N$34  (via drill 0.5, 0.6)
  Top 0.254: v31.93,105.21 30.59,105.21 R20.2 30.63,105.02 R19.1 | U4.7 35.5,108.58 v35.64,108.71 | R5.2 R27.2
  Bottom 0.254: v35.64,108.71 32.46,108.71 31.88,108.15 31.88,105.26 v31.93,105.21 31.7,104.98 31.7,95.22 34.34,92.58 34.34,76.4 34.54,76.2 R27.2
N$35
  Top 0.254: C15.1 R19.2 30.72,101.78 32.05,101.78 32.26,101.58 32.26,100.05 32.54,99.77 33.81,99.77 34.2,100.16 U4.12
N$36
  Top 0.254: SJ4.2 31.01,99.31 31.39,98.93 34.14,98.93 34.85,99.64 U4.13
PD
  Top 0.305: R16.2 29.38,44.9 27.65,42.91 15.1,42.91 14.24,43.78 12.79,43.78 12.1,43.09 12.1,29.38 9.7,26.98 5.84,26.98 U1.6
PTT
  Top 0.305: R10.1 34.01,40.88 35.15,39.74 36.58,39.74 U3.9
PTT-1  (via drill 0.6)
  Top 0.61: U1.5 8.25,31.51 9.13,32.38 9.13,33.64 v9.51,34.02
  Bottom 0.61: v9.51,34.02 9.51,31.52 Q3.3
RMIC  (via drill 0.5, 0.6)
  Top 0.254: v37.92,44.55 37.11,43.66 36.6,43.66 U3.3
  Top 0.305: C10.1 32.99,17.12 | 32.99,17.12 R9.1 33.02,15.67 | 33.02,15.67 33.02,15.59 C8.1 | 32.99,17.12 32.99,15.7 33.02,15.67 | 33.02,15.67 v31.8,15.67
  Bottom 0.254: J2.1 29.59,11.43 31.8,13.64 v31.8,15.67
  Bottom 0.305: v31.8,15.67 31.8,19.43 32.66,20.3 32.66,30.2 31.72,31.14 28.9,31.14 27.86,32.18 27.86,36.07 29.08,37.29 29.11,37.29 29.62,37.8 29.62,39.14 31.22,40.74 35.41,40.74 36.02,41.35 36.02,43.81 36.22,44.02 37.44,44.02 v37.92,44.55
RXD  (via drill 0.6)
  Top 0.305: U3.10 36.6,39.09 36.6,38.37 36.02,37.78 v35.23,37.78 Q2.3 32.84,37.62 JP6.2
  Bottom 0.305: R1.1 35.19,37.74 v35.23,37.78
S1  (via drill 0.6)
  Top 0.254: U4.14 35.5,94.6 v36.42,93.67
  Top 0.305: v39.67,59 48.79,59 v49.02,58.78 | v49.48,55.78 49.48,47.09 48.36,45.97 48.36,42.9 47.78,42.32 44.42,42.32 U3.16
  Bottom 0.254: v36.42,93.67 R24.1
  Bottom 0.305: R24.1 37.89,92.52 38.81,91.59 38.81,59.87 v39.67,59 | v49.02,58.78 49.02,56.24 v49.48,55.78
S2  (via drill 0.6)
  Top 0.254: U4.15 36.15,95.75 v36.4,95.5
  Top 0.305: v38.84,57.48 49.68,57.48 51.16,56.01 51.16,46.79 50.57,46.2 49.71,46.2 49.3,45.8 49.3,42.62 48.36,41.68 44.41,41.68 U3.15
  Bottom 0.254: v36.4,95.5 37.57,95.5 37.71,95.5 R23.1
  Bottom 0.305: R23.1 37.74,95.33 37.57,95.5 35.53,95.5 35.05,95.02 35.05,92.73 35.64,92.15 37.16,92.15 38.1,91.21 38.1,58.22 v38.84,57.48
TXD  (via drill 0.6)
  Top 0.305: v40.77,45.74 42.28,44.23 42.28,40.04 42.57,39.75 U3.12 44.4,39.74 46.55,39.74 v46.77,39.51
  Top 0.406: v33.82,46.56 33.13,46.56 32.14,47.55 32.14,48.75 Q1.3
  Bottom 0.305: v40.77,45.74 34.63,45.74 v33.82,46.56 | JP6.1 45.7,34.01 47.12,35.43 47.12,39.17 v46.77,39.51
  Bottom 0.406: R2.1 33.06,47.32 v33.82,46.56
V+  (via drill 0.6)
  Top 0.305: Q2.1 30.43,38.78 R4.2 28.42,40.63 v28.79,41
  Top 0.406: Q1.1 29.89,49.64 R3.2 28.12,51.79 v27.84,52.07
  Top 1.422: v59.69,46.99 59.59,47.09 C19.A 56.53,47.1 R22.2 53.57,51.84 v53.34,52.07
  Bottom 0.305: v28.79,41 20.51,41 20.32,41.19
  Bottom 1.422: v53.34,52.07 v27.84,52.07 22.86,52.07 20.32,49.53 20.32,41.19 20.32,18.58 19.91,18.17 18.72,18.17 L2.1
  other vias: 59.69,53.34 60.96,53.34 62.23,53.34 63.5,53.34 64.77,53.34 66.04,53.34 67.31,53.34 68.58,53.34 69.85,53.34 59.69,52.07 60.96,52.07 62.23,52.07 63.5,52.07 64.77,52.07 66.04,52.07 67.31,52.07 68.58,52.07 69.85,52.07 59.69,50.8 60.96,50.8 68.58,50.8 69.85,50.8 59.69,49.53 60.96,49.53 59.69,48.26 59.69,45.72 68.58,49.53 69.85,49.53 68.58,48.26 69.85,48.26 68.58,46.99 69.85,46.99 68.58,45.72 69.85,45.72 60.96,48.26 60.96,46.99 60.96,45.72 62.23,50.8 63.5,50.8 64.77,50.8 66.04,50.8 67.31,50.8
  pour Top: 59.11,44.09 71.22,44.09 71.22,54.2 59.11,54.2
  pour Bottom: 59.05,44.07 71.22,44.07 71.22,54.2 59.05,54.2
VBAT
  Top 0.254: 75.18,85.45 75.54,85.45 76.45,86.36 81.13,86.36 81.15,86.39
  Top 0.406: C16.A 43.31,99.67 43.33,99.64 43.81,99.64 44.48,98.98
  Top 1.676: U$2.S2 52.03,15 53.7,16.66 70.97,16.66 74.07,19.76 74.09,19.76 75.21,20.83 75.21,51.94 75.18,57.99 75.18,85.45 76.05,86.31 81.23,86.31 JP1.1 | 81.15,86.39 81.15,95.4 77.57,98.98 44.48,98.98
  pour Top: 37.34,102.11 38.61,102.11 38.86,101.85 38.86,100.58 39.12,100.33 43.94,100.33 44.45,99.82 44.45,98.04 44.2,97.79 37.85,97.79 37.34,98.3
VDD
  Top 0.305: R8.2 34.83,20.67 35.15,20.99 35.15,23.84 34.86,24.13 U2.3 34.75,24.13 35.12,24.5 35.12,26.63 35.08,26.67 | 40.13,31.01 40.09,30.72 40.09,30.14 40.97,29.26 46.51,29.26 47.57,28.19 47.57,22.02 42.39,16.84 42.39,11.05 42.95,10.49 51.31,10.49 52.02,9.78 52.02,6.72 U$2.3
  Top 0.813: U2.1 35.08,26.67 35.38,26.98 35.38,28.08 | 35.38,28.08 35.38,30.67 35.73,31.01 40.13,31.01 L3.2 | C20.1 35.46,28.16 35.38,28.08
VOLT
  Top 0.305: U3.14 49.42,41.05 49.75,41.38 49.75,41.72 49.82,41.8 R25.1
  Top 0.406: R26.2 R25.1

### Text on the board
tNames: ZIPS EV | RJ